# EAGLE schematic adapter (EAGLE 8.2.1)
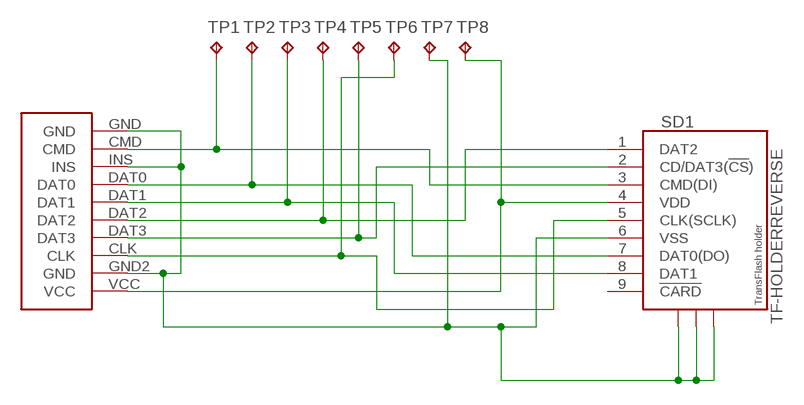
[diagram p0: schematic, sheet 1]

## Parts
SD1  TF-HOLDERREVERSE  [TF-PULL-REVERSE]
TP1  TPTP20R  [TP20R]
TP2  TPTP20R  [TP20R]
TP3  TPTP20R  [TP20R]
TP4  TPTP20R  [TP20R]
TP5  TPTP20R  [TP20R]
TP6  TPTP20R  [TP20R]
TP7  TPTP20R  [TP20R]
TP8  TPTP20R  [TP20R]
U$1  CONNECTOR  [CONNECTOR]

## Nets
GND: SD1.6(VSS) SD1.S1 SD1.S2 SD1.S3 TP7.TP U$1.GND U$1.GND2(GND) U$1.INS
N$1: SD1.4(VDD) TP8.TP U$1.VCC
N$3: SD1.3(CMD(DI)) TP1.TP U$1.CMD
N$5: SD1.7(DAT0(DO)) TP2.TP U$1.DAT0
N$6: SD1.8(DAT1) TP3.TP U$1.DAT1
N$7: SD1.1(DAT2) TP4.TP U$1.DAT2
N$8: SD1.2(CD/DAT3(!CS!)) TP5.TP U$1.DAT3
N$9: SD1.5(CLK(SCLK)) TP6.TP U$1.CLK
Unconnected: SD1.9(!CARD)

## Library data of the parts
SD1 = sd-mmc:TF-HOLDER: TF / Micro SD socket is PUSH-PUSH type, the card can be pushed into and auto locked and pushed out by simply press the card. Surface Mounting type.
TP1-TP8 = testpad:TP: Test pad
U$1 = untitled:CONNECTOR